# Altium schematic sheet kernel.SchDoc
size A1
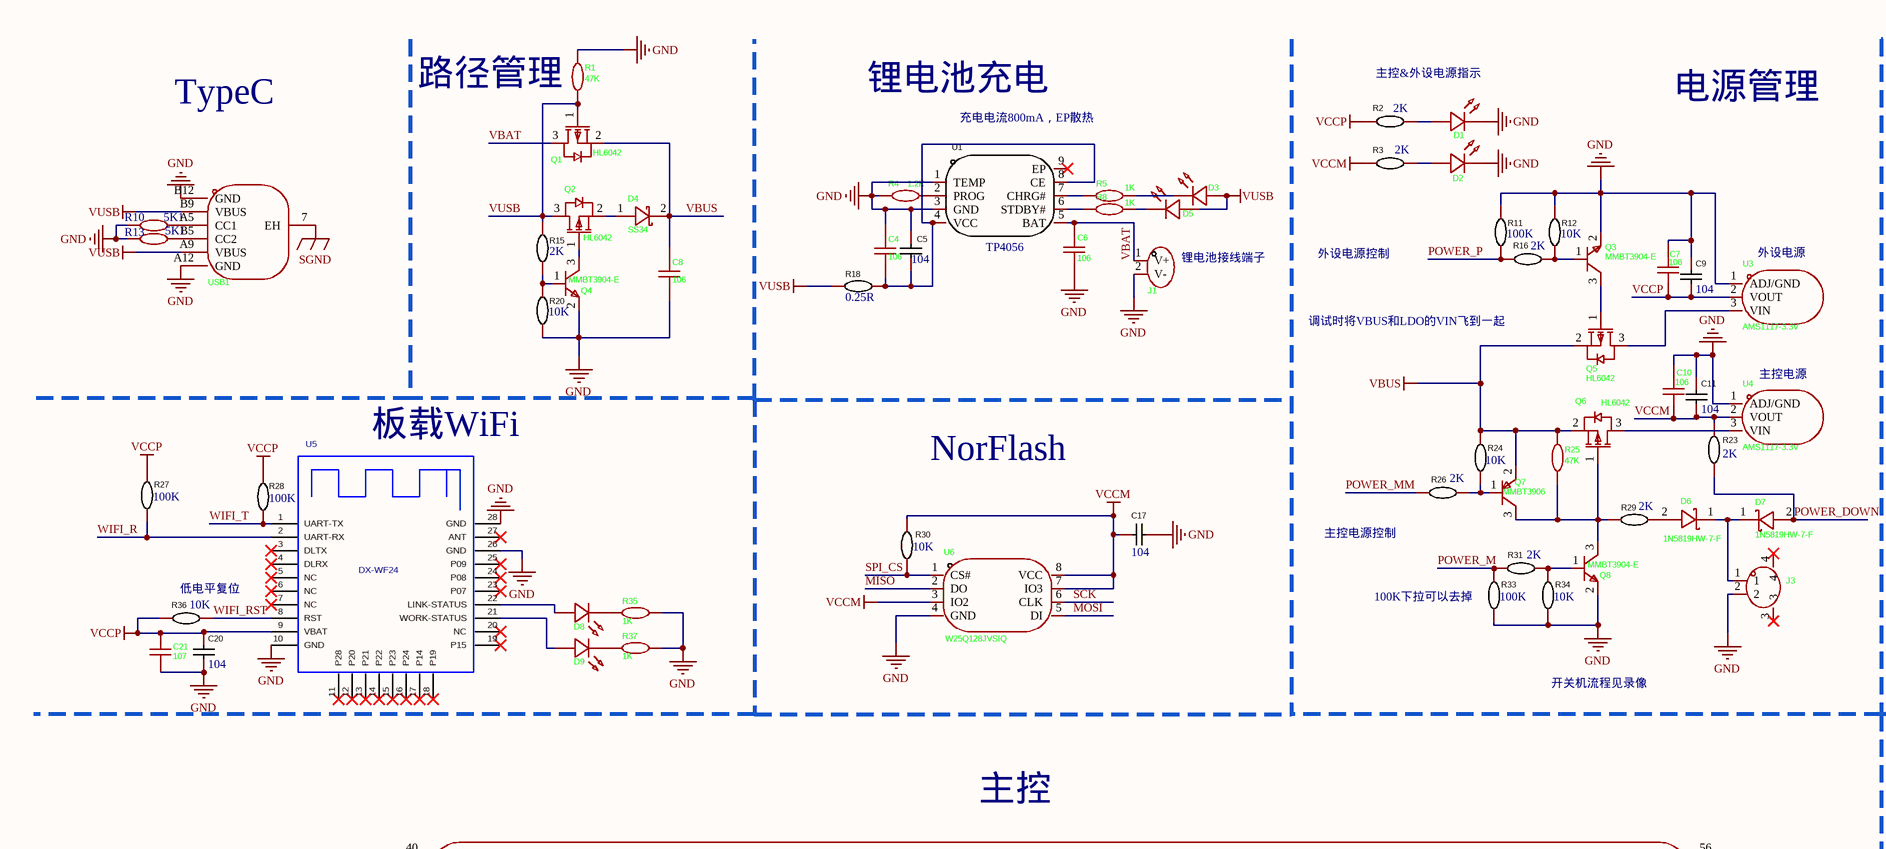
[diagram p0: kernel.SchDoc, top left]
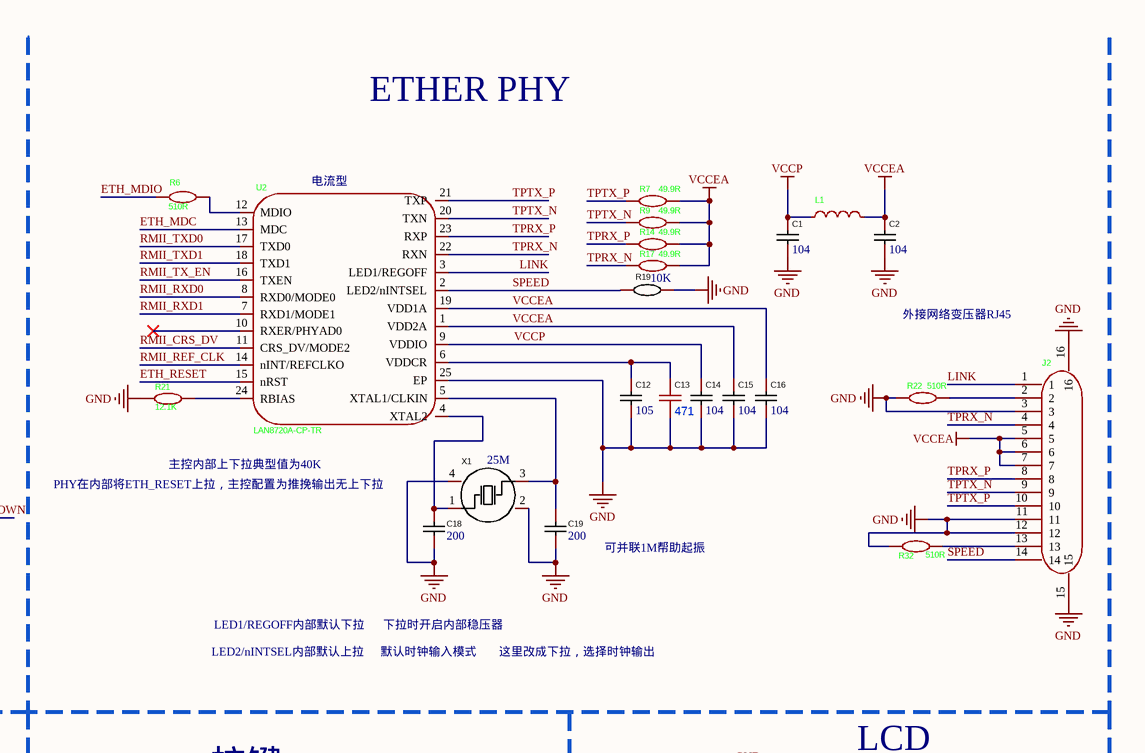
[diagram p1: kernel.SchDoc, top right]
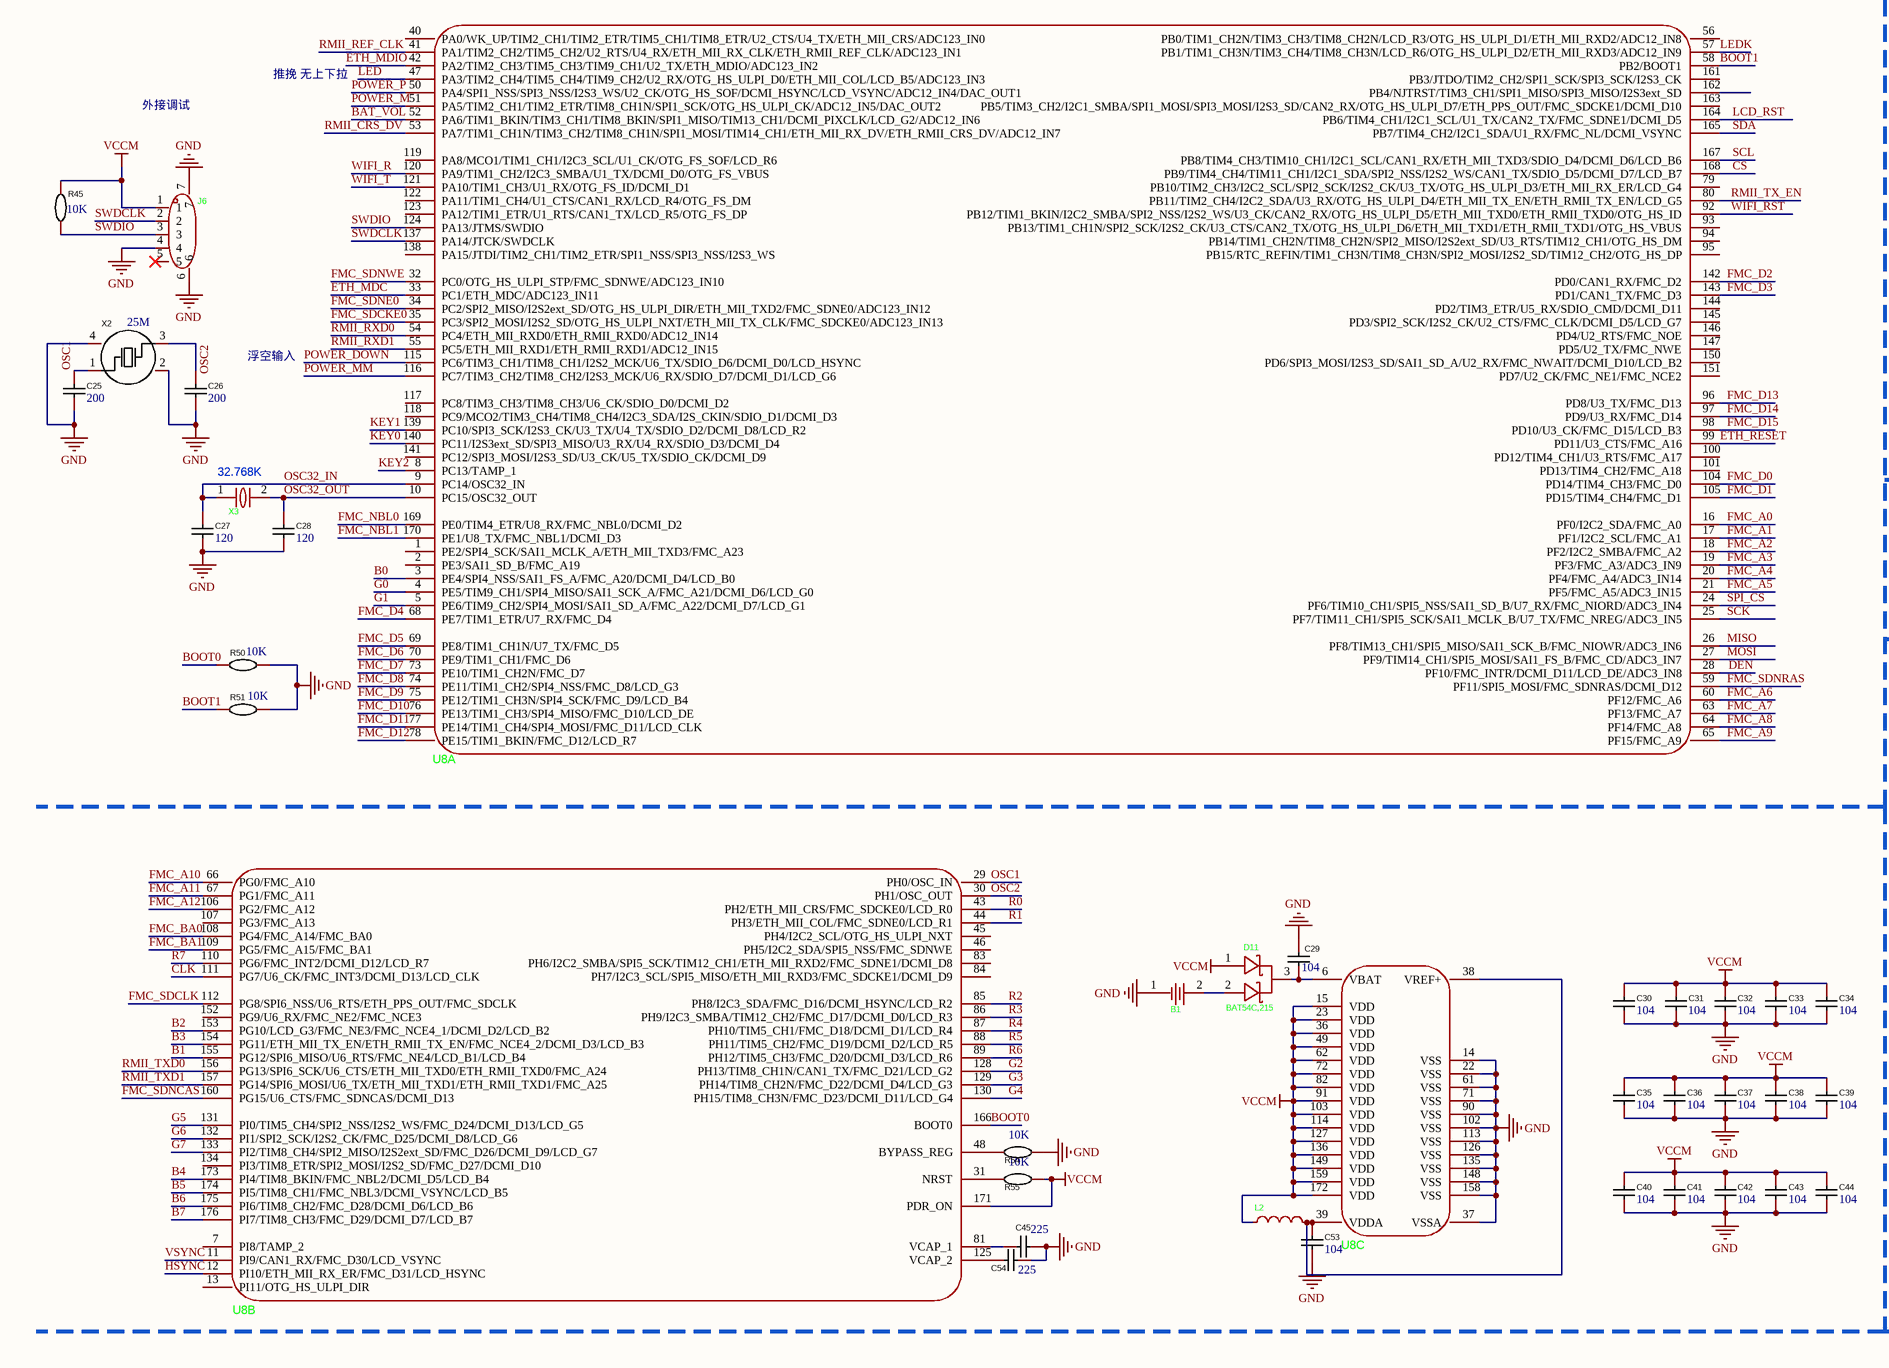
[diagram p2: kernel.SchDoc, bottom left]
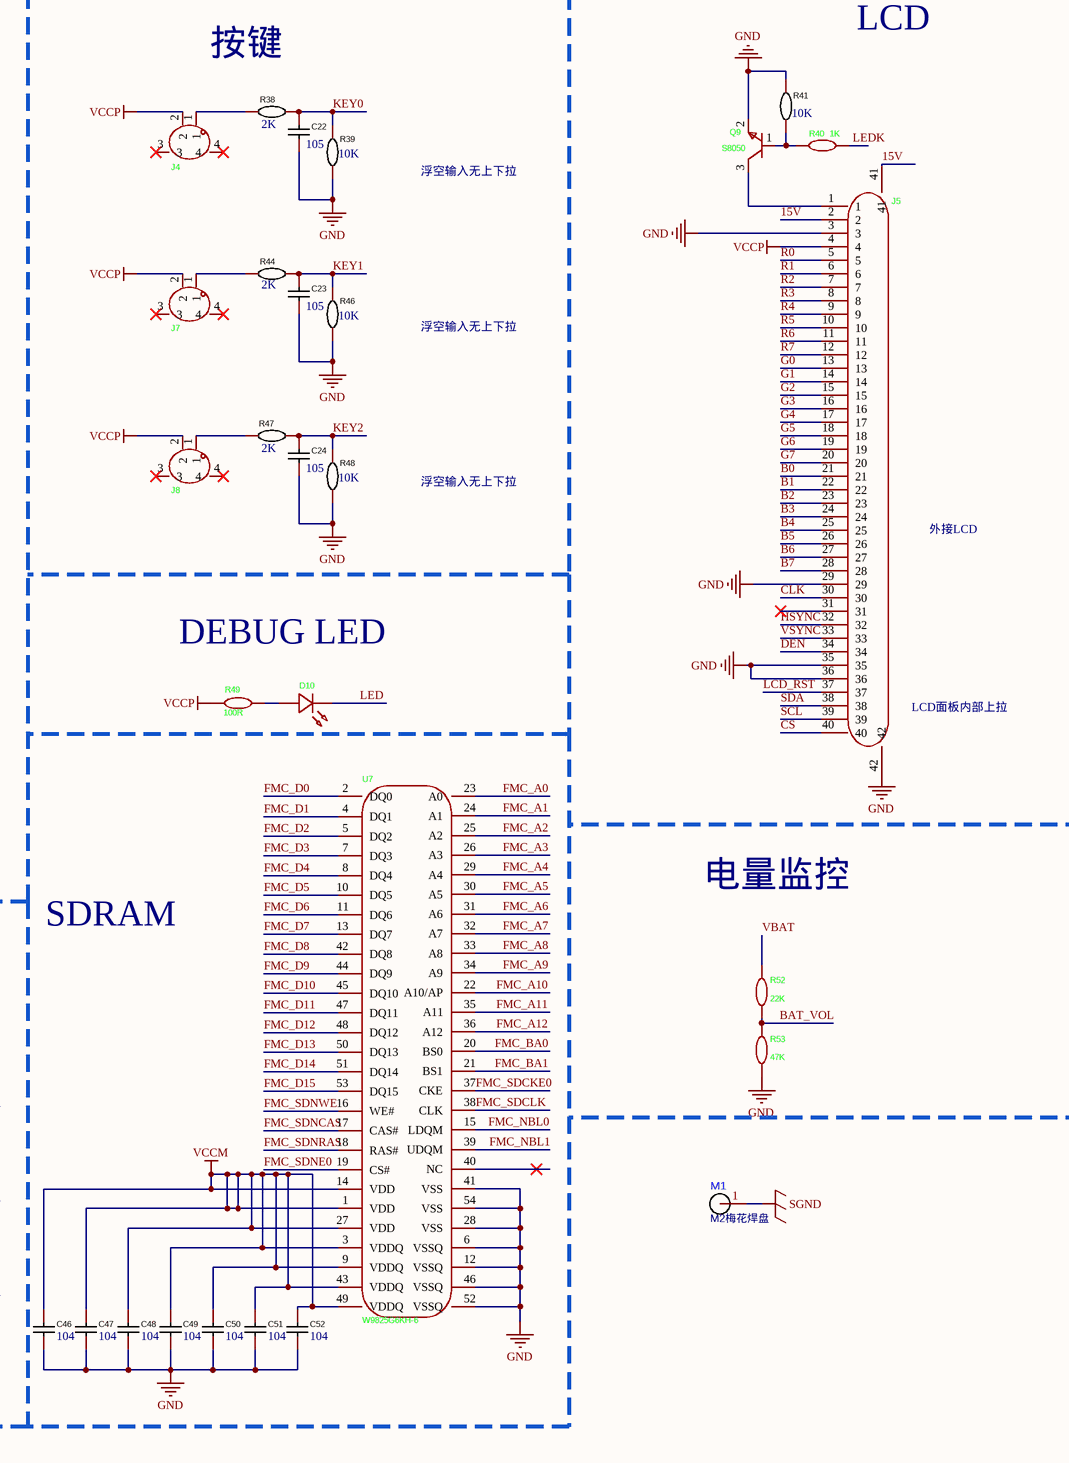
[diagram p3: kernel.SchDoc, bottom right]

## Parts
B1  BS-02-A1AJ010  [BAT-TH_BS-02-A1AJ010]  (value not drawn)
C1  104  [0402_C]
C2  104  [0402_C]
C4  106  [0603_C]
C5  104  [0402_C]
C6  106  [0603_C]
C7  106  [0603_C]
C8  106  [0603_C]
C9  104  [0402_C]
C10  106  [0603_C]
C11  104  [0402_C]
C12  105  [0402_C]
C13  471  [0402_C]
C14  104  [0402_C]
C15  104  [0402_C]
C16  104  [0402_C]
C17  104  [0402_C]
C18  200  [0402_C]
C19  200  [0402_C]
C20  104  [0402_C]
C21  107  [1206_C]
C22  105  [0402_C]
C23  105  [0402_C]
C24  105  [0402_C]
C25  200  [0402_C]
C26  200  [0402_C]
C27  120  [0402_C]
C28  120  [0402_C]
C29  104  [0402_C]
C30  104  [0402_C]
C31  104  [0402_C]
C32  104  [0402_C]
C33  104  [0402_C]
C34  104  [0402_C]
C35  104  [0402_C]
C36  104  [0402_C]
C37  104  [0402_C]
C38  104  [0402_C]
C39  104  [0402_C]
C40  104  [0402_C]
C41  104  [0402_C]
C42  104  [0402_C]
C43  104  [0402_C]
C44  104  [0402_C]
C45  225  [0402_C]
C46  104  [0402_C]
C47  104  [0402_C]
C48  104  [0402_C]
C49  104  [0402_C]
C50  104  [0402_C]
C51  104  [0402_C]
C52  104  [0402_C]
C53  104  [0402_C]
C54  225  [0402_C]
D1  XL-1005SYGC  [LED-SMD_L1.1-W0.6-FD]  (value not drawn)
D2  XL-1005SYGC  [LED-SMD_L1.1-W0.6-FD]  (value not drawn)
D3  XL-1005SYGC  [LED-SMD_L1.1-W0.6-FD]  (value not drawn)
D4  SS34  [SMA_L4.3-W2.6-LS5.0-FD]
D5  XL-1005SURC  [LED0402-RD]  (value not drawn)
D6  1N5819HW-7-F  [SOD-123_L2.7-W1.6-LS3.7-RD]
D7  1N5819HW-7-F  [SOD-123_L2.7-W1.6-LS3.7-RD]
D8  XL-1005SURC  [LED0402-RD]  (value not drawn)
D9  XL-1005SURC  [LED0402-RD]  (value not drawn)
D10  XL-1005UOC  [LED0402-RD_ORANGE]  (value not drawn)
D11  BAT54C,215  [SOT-23-3_L2.9-W1.6-P1.90-LS2.8-BR]
J1  ZX-XH2.54-2PZZ  [CONN-TH_2P-P2.50_HX25003-2A]  (value not drawn)
J2  AFC01-S14FCA-00  [FPC-SMD_AFC01-S14FCA-00]  (value not drawn)
J3  WAFER-SH1.0-2PWB  [CONN-SMD_2P-P1.00_XUNPU_WAFER-SH1.0-2PWB]  (value not drawn)
J4  WAFER-SH1.0-2PWB  [CONN-SMD_2P-P1.00_XUNPU_WAFER-SH1.0-2PWB]  (value not drawn)
J5  AFC01-S40FCA-00  [FPC-SMD_AFC01-S40FCA-00]  (value not drawn)
J6  AFC01-S05FCA-00  [FPC-SMD_AFC01-S05FCA-00]  (value not drawn)
J7  WAFER-SH1.0-2PWB  [CONN-SMD_2P-P1.00_XUNPU_WAFER-SH1.0-2PWB]  (value not drawn)
J8  WAFER-SH1.0-2PWB  [CONN-SMD_2P-P1.00_XUNPU_WAFER-SH1.0-2PWB]  (value not drawn)
L1  BLM21PG221SN1D  [0805_L]  (value not drawn)
L2  BLM15AG100SN1D  [0402_L]  (value not drawn)
M1  M2梅花焊盘  [PCBComponent_1 - duplicate]
Q1  HL6042  [SOT-23-3_L2.9-W1.4-P1.90-LS2.5-BR]
Q2  HL6042  [SOT-23-3_L2.9-W1.4-P1.90-LS2.5-BR]
Q3  MMBT3904-E  [SOT-23-3_L2.9-W1.4-P1.90-LS2.5-BR]
Q4  MMBT3904-E  [SOT-23-3_L2.9-W1.4-P1.90-LS2.5-BR]
Q5  HL6042  [SOT-23-3_L2.9-W1.4-P1.90-LS2.5-BR]
Q6  HL6042  [SOT-23-3_L2.9-W1.4-P1.90-LS2.5-BR]
Q7  MMBT3906  [SOT-23-3_L2.9-W1.3-P1.90-LS2.4-BR]
Q8  MMBT3904-E  [SOT-23-3_L2.9-W1.4-P1.90-LS2.5-BR]
Q9  S8050  [SOT-23-3_L3.0-W1.7-P0.95-LS2.9-BR]
R1  47K  [0402_R]
R2  2K  [0402_R]
R3  2K  [0402_R]
R4  1.2K  [0603_R]
R5  1K  [0402_R]
R6  510R  [0603_R]
R7  49.9R  [0603_R]
R8  1K  [0402_R]
R9  49.9R  [0603_R]
R10  5K1  [0402_R]
R11  100K  [0402_R]
R12  10K  [0402_R]
R13  5K1  [0402_R]
R14  49.9R  [0603_R]
R15  2K  [0402_R]
R16  2K  [0402_R]
R17  49.9R  [0603_R]
R18  0.25R  [1206_R]
R19  10K  [0402_R]
R20  10K  [0402_R]
R21  12.1K  [0603_R]
R22  510R  [0603_R]
R23  2K  [0402_R]
R24  10K  [0402_R]
R25  47K  [0402_R]
R26  2K  [0402_R]
R27  100K  [0402_R]
R28  100K  [0402_R]
R29  2K  [0402_R]
R30  10K  [0402_R]
R31  2K  [0402_R]
R32  510R  [0603_R]
R33  100K  [0402_R]
R34  10K  [0402_R]
R35  1K  [0402_R]
R36  10K  [0402_R]
R37  1K  [0402_R]
R38  2K  [0402_R]
R39  10K  [0402_R]
R40  1K  [0402_R]
R41  10K  [0402_R]
R44  2K  [0402_R]
R45  10K  [0402_R]
R46  10K  [0402_R]
R47  2K  [0402_R]
R48  10K  [0402_R]
R49  100R  [0402_R]
R50  10K  [0402_R]
R51  10K  [0402_R]
R52  22K  [0402_R]
R53  47K  [0402_R]
R54  10K  [0402_R]
R55  10K  [0402_R]
U1  TP4056  [ESOP-8_L4.9-W3.9-P1.27-LS6.0-BL-EP]
U2  LAN8720A-CP-TR  [QFN-24_L4.0-W4.0-P0.50-BL-EP2.6]
U3  AMS1117-3.3V  [SOT-89-3_L4.5-W2.5-P1.50-LS4.2-BR]
U4  AMS1117-3.3V  [SOT-89-3_L4.5-W2.5-P1.50-LS4.2-BR]
U5  DX-WF24  [DX-WF24-SMT]
U6  W25Q128JVSIQ  [SOIC-8_L5.3-W5.3-P1.27-LS8.0-BL]
U7  W9825G6KH-6  [TSOP-54_L22.2-W10.2-P0.80-LS11.8-BL]
U8  STM32F429IGT6  [LQFP-176_L24.0-W24.0-P0.50-LS26.0-BL]  (value not drawn)  (parts A,B,C of 3)
USB1  TYPE-C 6P  [TYPE-C-SMD_TYPE-C-6P]  (value not drawn)
X1  25M  [SMD-3225_4P]
X2  25M  [SMD-3225_4P]
X3  32.768K  [SMD3225-2P]

## Nets
GND: B1.1 C1.1 C2.1 C4.2 C5.2 C6.1 C7.2 C8.1 C9.2 C10.2 C11.2 C12.1 C13.1 C14.1 C15.1 C16.1 C17.2 C18.2 C19.2 C20.1 C21.1 C22.1 C23.1 C24.1 C25.2 C26.2 C27.1 C28.1 C29.2 C30.1 C31.1 C32.1 C33.1 C34.1 C35.1 C36.1 C37.1 C38.1 C39.1 C40.1 C41.1 C42.1 C43.1 C44.1 C45.2 C46.1 C47.1 C48.1 C49.1 C50.1 C51.1 C52.1 C53.1 C54.2 D1.1(K) D2.1(K) J1.2(V-) J2.3 J2.11 J2.12 J2.15 J2.16 J3.2 J5.3 J5.29 J5.35 J5.36 J5.42 J6.4 J6.6 J6.7 Q3.2(E) Q4.2(E) Q8.2(E) Q9.2(E) R1.2 R4.1 R10.1 R11.2 R12.2 R13.1 R19.2 R20.1 R21.1 R22.1 R32.1 R33.1 R34.1 R35.2 R37.2 R39.2 R41.2 R46.2 R48.2 R50.2 R51.2 R53.1 R54.2 U1.1(TEMP) U1.3(GND) U2.25(EP) U3.1(ADJ/GND) U4.1(ADJ/GND) U5.10(GND) U5.26(GND) U5.28(GND) U6.4(GND) U7.6(VSSQ) U7.12(VSSQ) U7.28(VSS) U7.41(VSS) U7.46(VSSQ) U7.52(VSSQ) U7.54(VSS) U8.14(VSS) U8.22(VSS) U8.37(VSSA) U8.61(VSS) U8.71(VSS) U8.90(VSS) U8.102(VSS) U8.113(VSS) U8.126(VSS) U8.135(VSS) U8.148(VSS) U8.158(VSS) USB1.A12(GND) USB1.B12(GND) X1.2(GND) X1.4(GND) X2.2(GND) X2.4(GND)
SGND: M1.1 USB1.7(EH)
VBUS: C8.2 D4.2(K) Q1.2(S) Q5.2(S) Q6.2(S) Q7.2(E) R24.2 R25.2
VCCEA: C2.2 C15.2 C16.2 J2.5 J2.6 J2.7 L1.2 R7.2 R9.2 R14.2 R17.2 U2.1(VDD2A) U2.19(VDD1A)
VCCM: C10.1 C11.1 C17.1 C30.2 C31.2 C32.2 C33.2 C34.2 C35.2 C36.2 C37.2 C38.2 C39.2 C40.2 C41.2 C42.2 C43.2 C44.2 C46.2 C47.2 C48.2 C49.2 C50.2 C51.2 C52.2 D11.1(A) J6.1 L2.1 R3.1 R23.2 R30.2 R45.1 R55.2 U4.2(VOUT) U6.3(IO2) U6.7(IO3) U6.8(VCC) U7.1(VDD) U7.3(VDDQ) U7.9(VDDQ) U7.14(VDD) U7.27(VDD) U7.43(VDDQ) U7.49(VDDQ) U8.15(VDD) U8.23(VDD) U8.36(VDD) U8.49(VDD) U8.62(VDD) U8.72(VDD) U8.82(VDD) U8.91(VDD) U8.103(VDD) U8.114(VDD) U8.127(VDD) U8.136(VDD) U8.149(VDD) U8.159(VDD) U8.171(PDR_ON) U8.172(VDD)
VCCP: C1.2 C7.1 C9.1 C14.2 C20.2 C21.2 J4.2 J5.4 J7.2 J8.2 L1.1 R2.1 R27.2 R28.2 R36.2 R49.1 U2.9(VDDIO) U3.2(VOUT) U5.9(VBAT)
VUSB: D3.2(A) D5.2(A) Q1.1(G) Q2.3(D) R1.1 R15.1 R18.1 USB1.A9(VBUS) USB1.B9(VBUS)
15V: J5.2 J5.41
B0: J5.21 U8.3(PE4/SPI4_NSS/SAI1_FS_A/FMC_A20/DCMI_D4/LCD_B0)
B1: J5.22 U8.155(PG12/SPI6_MISO/U6_RTS/FMC_NE4/LCD_B1/LCD_B4)
B2: J5.23 U8.153(PG10/LCD_G3/FMC_NE3/FMC_NCE4_1/DCMI_D2/LCD_B2)
B3: J5.24 U8.154(PG11/ETH_MII_TX_EN/ETH_RMII_TX_EN/FMC_NCE4_2/DCMI_D3/LCD_B3)
B4: J5.25 U8.173(PI4/TIM8_BKIN/FMC_NBL2/DCMI_D5/LCD_B4)
B5: J5.26 U8.174(PI5/TIM8_CH1/FMC_NBL3/DCMI_VSYNC/LCD_B5)
B6: J5.27 U8.175(PI6/TIM8_CH2/FMC_D28/DCMI_D6/LCD_B6)
B7: J5.28 U8.176(PI7/TIM8_CH3/FMC_D29/DCMI_D7/LCD_B7)
BAT_VOL: R52.1 R53.2 U8.52(PA6/TIM1_BKIN/TIM3_CH1/TIM8_BKIN/SPI1_MISO/TIM13_CH1/DCMI_PIXCLK/LCD_G2/ADC12_IN6)
BOOT0: R50.1 U8.166(BOOT0)
BOOT1: R51.1 U8.58(PB2/BOOT1)
CLK: J5.30 U8.111(PG7/U6_CK/FMC_INT3/DCMI_D13/LCD_CLK)
CS: J5.40 U8.168(PB9/TIM4_CH4/TIM11_CH1/I2C1_SDA/SPI2_NSS/I2S2_WS/CAN1_TX/SDIO_D5/DCMI_D7/LCD_B7)
DEN: J5.34 U8.28(PF10/FMC_INTR/DCMI_D11/LCD_DE/ADC3_IN8)
ETH_MDC: U2.13(MDC) U8.33(PC1/ETH_MDC/ADC123_IN11)
ETH_MDIO: R6.1 U8.42(PA2/TIM2_CH3/TIM5_CH3/TIM9_CH1/U2_TX/ETH_MDIO/ADC123_IN2)
ETH_RESET: U2.15(nRST) U8.99(PD11/U3_CTS/FMC_A16)
FMC_A0: U7.23(A0) U8.16(PF0/I2C2_SDA/FMC_A0)
FMC_A1: U7.24(A1) U8.17(PF1/I2C2_SCL/FMC_A1)
FMC_A2: U7.25(A2) U8.18(PF2/I2C2_SMBA/FMC_A2)
FMC_A3: U7.26(A3) U8.19(PF3/FMC_A3/ADC3_IN9)
FMC_A4: U7.29(A4) U8.20(PF4/FMC_A4/ADC3_IN14)
FMC_A5: U7.30(A5) U8.21(PF5/FMC_A5/ADC3_IN15)
FMC_A6: U7.31(A6) U8.60(PF12/FMC_A6)
FMC_A7: U7.32(A7) U8.63(PF13/FMC_A7)
FMC_A8: U7.33(A8) U8.64(PF14/FMC_A8)
FMC_A9: U7.34(A9) U8.65(PF15/FMC_A9)
FMC_A10: U7.22(A10/AP) U8.66(PG0/FMC_A10)
FMC_A11: U7.35(A11) U8.67(PG1/FMC_A11)
FMC_A12: U7.36(A12) U8.106(PG2/FMC_A12)
FMC_BA0: U7.20(BS0) U8.108(PG4/FMC_A14/FMC_BA0)
FMC_BA1: U7.21(BS1) U8.109(PG5/FMC_A15/FMC_BA1)
FMC_D0: U7.2(DQ0) U8.104(PD14/TIM4_CH3/FMC_D0)
FMC_D1: U7.4(DQ1) U8.105(PD15/TIM4_CH4/FMC_D1)
FMC_D2: U7.5(DQ2) U8.142(PD0/CAN1_RX/FMC_D2)
FMC_D3: U7.7(DQ3) U8.143(PD1/CAN1_TX/FMC_D3)
FMC_D4: U7.8(DQ4) U8.68(PE7/TIM1_ETR/U7_RX/FMC_D4)
FMC_D5: U7.10(DQ5) U8.69(PE8/TIM1_CH1N/U7_TX/FMC_D5)
FMC_D6: U7.11(DQ6) U8.70(PE9/TIM1_CH1/FMC_D6)
FMC_D7: U7.13(DQ7) U8.73(PE10/TIM1_CH2N/FMC_D7)
FMC_D8: U7.42(DQ8) U8.74(PE11/TIM1_CH2/SPI4_NSS/FMC_D8/LCD_G3)
FMC_D9: U7.44(DQ9) U8.75(PE12/TIM1_CH3N/SPI4_SCK/FMC_D9/LCD_B4)
FMC_D10: U7.45(DQ10) U8.76(PE13/TIM1_CH3/SPI4_MISO/FMC_D10/LCD_DE)
FMC_D11: U7.47(DQ11) U8.77(PE14/TIM1_CH4/SPI4_MOSI/FMC_D11/LCD_CLK)
FMC_D12: U7.48(DQ12) U8.78(PE15/TIM1_BKIN/FMC_D12/LCD_R7)
FMC_D13: U7.50(DQ13) U8.96(PD8/U3_TX/FMC_D13)
FMC_D14: U7.51(DQ14) U8.97(PD9/U3_RX/FMC_D14)
FMC_D15: U7.53(DQ15) U8.98(PD10/U3_CK/FMC_D15/LCD_B3)
FMC_NBL0: U7.15(LDQM) U8.169(PE0/TIM4_ETR/U8_RX/FMC_NBL0/DCMI_D2)
FMC_NBL1: U7.39(UDQM) U8.170(PE1/U8_TX/FMC_NBL1/DCMI_D3)
FMC_SDCKE0: U7.37(CKE) U8.35(PC3/SPI2_MOSI/I2S2_SD/OTG_HS_ULPI_NXT/ETH_MII_TX_CLK/FMC_SDCKE0/ADC123_IN13)
FMC_SDCLK: U7.38(CLK) U8.112(PG8/SPI6_NSS/U6_RTS/ETH_PPS_OUT/FMC_SDCLK)
FMC_SDNCAS: U7.17(CAS#) U8.160(PG15/U6_CTS/FMC_SDNCAS/DCMI_D13)
FMC_SDNE0: U7.19(CS#) U8.34(PC2/SPI2_MISO/I2S2ext_SD/OTG_HS_ULPI_DIR/ETH_MII_TXD2/FMC_SDNE0/ADC123_IN12)
FMC_SDNRAS: U7.18(RAS#) U8.59(PF11/SPI5_MOSI/FMC_SDNRAS/DCMI_D12)
FMC_SDNWE: U7.16(WE#) U8.32(PC0/OTG_HS_ULPI_STP/FMC_SDNWE/ADC123_IN10)
G0: J5.13 U8.4(PE5/TIM9_CH1/SPI4_MISO/SAI1_SCK_A/FMC_A21/DCMI_D6/LCD_G0)
G1: J5.14 U8.5(PE6/TIM9_CH2/SPI4_MOSI/SAI1_SD_A/FMC_A22/DCMI_D7/LCD_G1)
G2: J5.15 U8.128(PH13/TIM8_CH1N/CAN1_TX/FMC_D21/LCD_G2)
G3: J5.16 U8.129(PH14/TIM8_CH2N/FMC_D22/DCMI_D4/LCD_G3)
G4: J5.17 U8.130(PH15/TIM8_CH3N/FMC_D23/DCMI_D11/LCD_G4)
G5: J5.18 U8.131(PI0/TIM5_CH4/SPI2_NSS/I2S2_WS/FMC_D24/DCMI_D13/LCD_G5)
G6: J5.19 U8.132(PI1/SPI2_SCK/I2S2_CK/FMC_D25/DCMI_D8/LCD_G6)
G7: J5.20 U8.133(PI2/TIM8_CH4/SPI2_MISO/I2S2ext_SD/FMC_D26/DCMI_D9/LCD_G7)
HSYNC: J5.32 U8.12(PI10/ETH_MII_RX_ER/FMC_D31/LCD_HSYNC)
KEY0: C22.2 R38.2 R39.1 U8.140(PC11/I2S3ext_SD/SPI3_MISO/U3_RX/U4_RX/SDIO_D3/DCMI_D4)
KEY1: C23.2 R44.2 R46.1 U8.139(PC10/SPI3_SCK/I2S3_CK/U3_TX/U4_TX/SDIO_D2/DCMI_D8/LCD_R2)
KEY2: C24.2 R47.2 R48.1 U8.8(PC13/TAMP_1)
LCD_RST: J5.37 U8.164(PB6/TIM4_CH1/I2C1_SCL/U1_TX/CAN2_TX/FMC_SDNE1/DCMI_D5)
LED: D10.1(K) U8.47(PA3/TIM2_CH4/TIM5_CH4/TIM9_CH2/U2_RX/OTG_HS_ULPI_D0/ETH_MII_COL/LCD_B5/ADC123_IN3)
LEDK: R40.2 U8.57(PB1/TIM1_CH3N/TIM3_CH4/TIM8_CH3N/LCD_R6/OTG_HS_ULPI_D2/ETH_MII_RXD3/ADC12_IN9)
LINK: J2.1 U2.3(LED1/REGOFF)
MISO: U6.2(DO) U8.26(PF8/TIM13_CH1/SPI5_MISO/SAI1_SCK_B/FMC_NIOWR/ADC3_IN6)
MOSI: U6.5(DI) U8.27(PF9/TIM14_CH1/SPI5_MOSI/SAI1_FS_B/FMC_CD/ADC3_IN7)
OSC1: C25.1 U8.29(PH0/OSC_IN) X2.1(OSC1)
OSC2: C26.1 U8.30(PH1/OSC_OUT) X2.3(OSC2)
OSC32_IN: C27.2 U8.9(PC14/OSC32_IN) X3.1
OSC32_OUT: C28.2 U8.10(PC15/OSC32_OUT) X3.2
POWER_DOWN: D7.2(A) R23.1 U8.115(PC6/TIM3_CH1/TIM8_CH1/I2S2_MCK/U6_TX/SDIO_D6/DCMI_D0/LCD_HSYNC)
POWER_M: R31.1 R33.2 U8.51(PA5/TIM2_CH1/TIM2_ETR/TIM8_CH1N/SPI1_SCK/OTG_HS_ULPI_CK/ADC12_IN5/DAC_OUT2)
POWER_MM: R26.1 U8.116(PC7/TIM3_CH2/TIM8_CH2/I2S3_MCK/U6_RX/SDIO_D7/DCMI_D1/LCD_G6)
POWER_P: R11.1 R16.1 U8.50(PA4/SPI1_NSS/SPI3_NSS/I2S3_WS/U2_CK/OTG_HS_SOF/DCMI_HSYNC/LCD_VSYNC/ADC12_IN4/DAC_OUT1)
R0: J5.5 U8.43(PH2/ETH_MII_CRS/FMC_SDCKE0/LCD_R0)
R1: J5.6 U8.44(PH3/ETH_MII_COL/FMC_SDNE0/LCD_R1)
R2: J5.7 U8.85(PH8/I2C3_SDA/FMC_D16/DCMI_HSYNC/LCD_R2)
R3: J5.8 U8.86(PH9/I2C3_SMBA/TIM12_CH2/FMC_D17/DCMI_D0/LCD_R3)
R4: J5.9 U8.87(PH10/TIM5_CH1/FMC_D18/DCMI_D1/LCD_R4)
R5: J5.10 U8.88(PH11/TIM5_CH2/FMC_D19/DCMI_D2/LCD_R5)
R6: J5.11 U8.89(PH12/TIM5_CH3/FMC_D20/DCMI_D3/LCD_R6)
R7: J5.12 U8.110(PG6/FMC_INT2/DCMI_D12/LCD_R7)
RMII_CRS_DV: U2.11(CRS_DV/MODE2) U8.53(PA7/TIM1_CH1N/TIM3_CH2/TIM8_CH1N/SPI1_MOSI/TIM14_CH1/ETH_MII_RX_DV/ETH_RMII_CRS_DV/ADC12_IN7)
RMII_REF_CLK: U2.14(nINT/REFCLKO) U8.41(PA1/TIM2_CH2/TIM5_CH2/U2_RTS/U4_RX/ETH_MII_RX_CLK/ETH_RMII_REF_CLK/ADC123_IN1)
RMII_RXD0: U2.8(RXD0/MODE0) U8.54(PC4/ETH_MII_RXD0/ETH_RMII_RXD0/ADC12_IN14)
RMII_RXD1: U2.7(RXD1/MODE1) U8.55(PC5/ETH_MII_RXD1/ETH_RMII_RXD1/ADC12_IN15)
RMII_TX_EN: U2.16(TXEN) U8.80(PB11/TIM2_CH4/I2C2_SDA/U3_RX/OTG_HS_ULPI_D4/ETH_MII_TX_EN/ETH_RMII_TX_EN/LCD_G5)
RMII_TXD0: U2.17(TXD0) U8.156(PG13/SPI6_SCK/U6_CTS/ETH_MII_TXD0/ETH_RMII_TXD0/FMC_A24)
RMII_TXD1: U2.18(TXD1) U8.157(PG14/SPI6_MOSI/U6_TX/ETH_MII_TXD1/ETH_RMII_TXD1/FMC_A25)
SCK: U6.6(CLK) U8.25(PF7/TIM11_CH1/SPI5_SCK/SAI1_MCLK_B/U7_TX/FMC_NREG/ADC3_IN5)
SCL: J5.39 U8.167(PB8/TIM4_CH3/TIM10_CH1/I2C1_SCL/CAN1_RX/ETH_MII_TXD3/SDIO_D4/DCMI_D6/LCD_B6)
SDA: J5.38 U8.165(PB7/TIM4_CH2/I2C1_SDA/U1_RX/FMC_NL/DCMI_VSYNC)
SPEED: J2.14 R19.1 U2.2(LED2/nINTSEL)
SPI_CS: R30.1 U6.1(CS#) U8.24(PF6/TIM10_CH1/SPI5_NSS/SAI1_SD_B/U7_RX/FMC_NIORD/ADC3_IN4)
SWDCLK: J6.2 U8.137(PA14/JTCK/SWDCLK)
SWDIO: J6.3 R45.2 U8.124(PA13/JTMS/SWDIO)
TPRX_N: J2.4 R17.1 U2.22(RXN)
TPRX_P: J2.8 R14.1 U2.23(RXP)
TPTX_N: J2.9 R9.1 U2.20(TXN)
TPTX_P: J2.10 R7.1 U2.21(TXP)
VBAT: C6.2 J1.1(V+) Q1.3(D) R52.2 U1.5(BAT)
VSYNC: J5.33 U8.11(PI9/CAN1_RX/FMC_D30/LCD_VSYNC)
WIFI_R: R27.1 U5.2(UART-RX) U8.120(PA9/TIM1_CH2/I2C3_SMBA/U1_TX/DCMI_D0/OTG_FS_VBUS)
WIFI_RST: R36.1 U5.8(RST) U8.92(PB12/TIM1_BKIN/I2C2_SMBA/SPI2_NSS/I2S2_WS/U3_CK/CAN2_RX/OTG_HS_ULPI_D5/ETH_MII_TXD0/ETH_RMII_TXD0/OTG_HS_ID)
WIFI_T: R28.1 U5.1(UART-TX) U8.121(PA10/TIM1_CH3/U1_RX/OTG_FS_ID/DCMI_D1)
NetB1_2: B1.2 D11.2(A)
NetC4_1: C4.1 C5.1 R18.2 U1.4(VCC) U1.8(CE)
NetC12_2: C12.2 C13.2 U2.6(VDDCR)
NetC18_1: C18.1 U2.4(XTAL2) X1.1(OSC1)
NetC19_1: C19.1 U2.5(XTAL1/CLKIN) X1.3(OSC2)
NetC29_1: C29.1 D11.3(K) U8.6(VBAT)
NetC45_1: C45.1 U8.81(VCAP_1)
NetC53_2: C53.2 L2.2 U8.38(VREF+) U8.39(VDDA)
NetC54_1: C54.1 U8.125(VCAP_2)
NetD1_2: D1.2(A) R2.2
NetD2_2: D2.2(A) R3.2
NetD3_1: D3.1(K) R5.2
NetD4_1: D4.1(A) Q2.2(S)
NetD5_1: D5.1(K) R8.2
NetD6_1: D6.1(K) D7.1(K) J3.1
NetD6_2: D6.2(A) R29.2
NetD8_1: D8.1(K) R35.1
NetD8_2: D8.2(A) U5.22(LINK-STATUS)
NetD9_1: D9.1(K) R37.1
NetD9_2: D9.2(A) U5.21(WORK-STATUS)
NetD10_2: D10.2(A) R49.2
NetJ2_2: J2.2 R22.2
NetJ2_13: J2.13 R32.2
NetJ4_1: J4.1 R38.1
NetJ5_1: J5.1 Q9.3(C)
NetJ7_1: J7.1 R44.1
NetJ8_1: J8.1 R47.1
NetQ2_1: Q2.1(G) Q4.3(C)
NetQ3_1: Q3.1(B) R12.1 R16.2
NetQ3_3: Q3.3(C) Q5.1(G)
NetQ4_1: Q4.1(B) R15.2 R20.2
NetQ5_3: Q5.3(D) U3.3(VIN)
NetQ6_1: Q6.1(G) Q7.3(C) Q8.3(C) R25.1 R29.1
NetQ6_3: Q6.3(D) U4.3(VIN)
NetQ7_1: Q7.1(B) R24.1 R26.2
NetQ8_1: Q8.1(B) R31.2 R34.2
NetQ9_1: Q9.1(B) R40.1 R41.1
NetR4_2: R4.2 U1.2(PROG)
NetR5_1: R5.1 U1.7(CHRG#)
NetR6_2: R6.2 U2.12(MDIO)
NetR8_1: R8.1 U1.6(STDBY#)
NetR10_2: R10.2 USB1.A5(CC1)
NetR13_2: R13.2 USB1.B5(CC2)
NetR21_2: R21.2 U2.24(RBIAS)
NetR54_1: R54.1 U8.48(BYPASS_REG)
NetR55_1: R55.1 U8.31(NRST)

Not connected (* = marked no-connect by the designer): J3 3* 4*; J4 3* 4*; J5 31*; J6 5*; J7 3* 4*; J8 3* 4*; U1 9(EP)*; U2 10(RXER/PHYAD0)*; U5 3(DLTX)* 4(DLRX)* 5(NC)* 6(NC)* 7(NC)* 11(P28)* 12(P20)* 13(P21)* 14(P22)* 15(P23)* 16(P24)* 17(P14)* 18(P19)* 19(P15)* 20(NC)* 23(P07)* 24(P08)* 25(P09)* 27(ANT)*; U7 40(NC)*; U8 1(PE2/SPI4_SCK/SAI1_MCLK_A/ETH_MII_TXD3/FMC_A23) 2(PE3/SAI1_SD_B/FMC_A19) 7(PI8/TAMP_2) 13(PI11/OTG_HS_ULPI_DIR) 40(PA0/WK_UP/TIM2_CH1/TIM2_ETR/TIM5_CH1/TIM8_ETR/U2_CTS/U4_TX/ETH_MII_CRS/ADC123_IN0) 45(PH4/I2C2_SCL/OTG_HS_ULPI_NXT) 46(PH5/I2C2_SDA/SPI5_NSS/FMC_SDNWE) 56(PB0/TIM1_CH2N/TIM3_CH3/TIM8_CH2N/LCD_R3/OTG_HS_ULPI_D1/ETH_MII_RXD2/ADC12_IN8) 79(PB10/TIM2_CH3/I2C2_SCL/SPI2_SCK/I2S2_CK/U3_TX/OTG_HS_ULPI_D3/ETH_MII_RX_ER/LCD_G4) 83(PH6/I2C2_SMBA/SPI5_SCK/TIM12_CH1/ETH_MII_RXD2/FMC_SDNE1/DCMI_D8) 84(PH7/I2C3_SCL/SPI5_MISO/ETH_MII_RXD3/FMC_SDCKE1/DCMI_D9) 93(PB13/TIM1_CH1N/SPI2_SCK/I2S2_CK/U3_CTS/CAN2_TX/OTG_HS_ULPI_D6/ETH_MII_TXD1/ETH_RMII_TXD1/OTG_HS_VBUS) 94(PB14/TIM1_CH2N/TIM8_CH2N/SPI2_MISO/I2S2ext_SD/U3_RTS/TIM12_CH1/OTG_HS_DM) 95(PB15/RTC_REFIN/TIM1_CH3N/TIM8_CH3N/SPI2_MOSI/I2S2_SD/TIM12_CH2/OTG_HS_DP) 100(PD12/TIM4_CH1/U3_RTS/FMC_A17) 101(PD13/TIM4_CH2/FMC_A18) 107(PG3/FMC_A13) 117(PC8/TIM3_CH3/TIM8_CH3/U6_CK/SDIO_D0/DCMI_D2) 118(PC9/MCO2/TIM3_CH4/TIM8_CH4/I2C3_SDA/I2S_CKIN/SDIO_D1/DCMI_D3) 119(PA8/MCO1/TIM1_CH1/I2C3_SCL/U1_CK/OTG_FS_SOF/LCD_R6) 122(PA11/TIM1_CH4/U1_CTS/CAN1_RX/LCD_R4/OTG_FS_DM) 123(PA12/TIM1_ETR/U1_RTS/CAN1_TX/LCD_R5/OTG_FS_DP) 134(PI3/TIM8_ETR/SPI2_MOSI/I2S2_SD/FMC_D27/DCMI_D10) 138(PA15/JTDI/TIM2_CH1/TIM2_ETR/SPI1_NSS/SPI3_NSS/I2S3_WS) 141(PC12/SPI3_MOSI/I2S3_SD/U3_CK/U5_TX/SDIO_CK/DCMI_D9) 144(PD2/TIM3_ETR/U5_RX/SDIO_CMD/DCMI_D11) 145(PD3/SPI2_SCK/I2S2_CK/U2_CTS/FMC_CLK/DCMI_D5/LCD_G7) 146(PD4/U2_RTS/FMC_NOE) 147(PD5/U2_TX/FMC_NWE) 150(PD6/SPI3_MOSI/I2S3_SD/SAI1_SD_A/U2_RX/FMC_NWAIT/DCMI_D10/LCD_B2) 151(PD7/U2_CK/FMC_NE1/FMC_NCE2) 152(PG9/U6_RX/FMC_NE2/FMC_NCE3) 161(PB3/JTDO/TIM2_CH2/SPI1_SCK/SPI3_SCK/I2S3_CK) 162(PB4/NJTRST/TIM3_CH1/SPI1_MISO/SPI3_MISO/I2S3ext_SD) 163(PB5/TIM3_CH2/I2C1_SMBA/SPI1_MOSI/SPI3_MOSI/I2S3_SD/CAN2_RX/OTG_HS_ULPI_D7/ETH_PPS_OUT/FMC_SDCKE1/DCMI_D10)

## Notes on the sheet
- TypeC
- 路径管理
- 锂电池充电
- (near U1) 充电电流800mA，EP散热
- 主控&外设电源指示
- 电源管理
- ETHER PHY
- (near U2) 电流型
- 锂电池接线端子
- 外设电源控制
- (near U3) 外设电源
- 调试时将VBUS和LDO的VIN飞到一起
- 外接网络变压器RJ45
- (near U4) 主控电源
- 板载WiFi
- NorFlash
- 主控内部上下拉典型值为40K
- 主控电源控制
- PHY在内部将ETH_RESET上拉，主控配置为推挽输出无上下拉
- (near R36) 低电平复位
- 100K下拉可以去掉
- (near C19) 可并联1M帮助起振
- LED2/nINTSEL内部默认上拉
- LED1/REGOFF内部默认下拉
- 默认时钟输入模式
- 下拉时开启内部稳压器
- 这里改成下拉，选择时钟输出
- 开关机流程见录像
- (near U8) 主控
- 按键
- LCD
- 外接调试
- 推挽 无上下拉
- 浮空输入无上下拉
- 浮空输入
- (near J5) 外接LCD
- DEBUG LED
- (near J5) LCD面板内部上拉
- 电量监控
- SDRAM

## Library data of the parts
B1 = BS-02-A1AJ010: CR2032电池座; Manufacturer: MYOUNG(美阳); Add into BOM: yes; Connector Type: 电池底座; Battery Type: CR2032; Symbol: BS-02-A1AJ010; Device: BS-02-A1AJ010; LCSC Part Name: 电池底座 适用电池:CR2032; Supplier Part: C5239862; Manufacturer Part: BS-02-A1AJ010; Supplier Footprint: 插件; JLCPCB Part Class: Extended Part; Datasheet: https://item.szlcsc.com/datasheet/BS-02-A1AJ010/5943286.html; Supplier: LCSC; Convert to PCB: yes; Contact Material: 磷青铜; Contact Plating: 镍; Operating Temperature: -25℃~+85℃
C1 C2 C5 C9 C11 C14-C17 C20 = 0402C_104: 电容100nf; Manufacturer: FH(风华); Name: 20pF; Symbol: 0402CG200J500NT; Add into BOM: yes; Value: 20pF; Tolerance: ±5%; Voltage Rated: 50V; Temperature Coefficient: C0G; Device: 0402CG200J500NT; LCSC Part Name: 20pF ±5% 50V; Supplier Part: C1554; Manufacturer Part: 0402CG200J500NT; Supplier Footprint: 0402; JLCPCB Part Class: Basic Part; Datasheet: https://atta.szlcsc.com/upload/public/pdf/source/20170923/C1554_1506149268708988361.pdf; Supplier: LCSC; Convert to PCB: yes
C4 C6-C8 C10 = CGA0603X5R106K100JT: 电容10uf; Manufacturer: HRE(芯声); Add into BOM: yes; Value: 10uF; Tolerance: ±10%; Voltage Rating: 10V; Temperature Coefficient: X5R; Symbol: CGA0603X5R106K100JT; Device: CGA0603X5R106K100JT; LCSC Part Name: 10uF ±10% 10V; Supplier Part: C6119842; Manufacturer Part: CGA0603X5R106K100JT; Supplier Footprint: 0603; JLCPCB Part Class: Extended Part; Supplier: LCSC; Convert to PCB: yes
C12 C22-C24 = 0402C_105: 电容1uf; Manufacturer: FH(风华); Name: 20pF; Symbol: 0402CG200J500NT; Add into BOM: yes; Value: 20pF; Tolerance: ±5%; Voltage Rated: 50V; Temperature Coefficient: C0G; Device: 0402CG200J500NT; LCSC Part Name: 20pF ±5% 50V; Supplier Part: C1554; Manufacturer Part: 0402CG200J500NT; Supplier Footprint: 0402; JLCPCB Part Class: Basic Part; Datasheet: https://atta.szlcsc.com/upload/public/pdf/source/20170923/C1554_1506149268708988361.pdf; Supplier: LCSC; Convert to PCB: yes
C13 = 0402B471K500NT: 电容470pf; Manufacturer: FH(风华); Add into BOM: yes; Value: 470pF; Tolerance: ±10%; Voltage Rating: 50V; Temperature Coefficient: X7R; Symbol: 0402B471K500NT; Device: 0402B471K500NT; LCSC Part Name: 470pF ±10% 50V; Supplier Part: C1537; Manufacturer Part: 0402B471K500NT; Supplier Footprint: 0402; JLCPCB Part Class: Extended Part; Datasheet: https://item.szlcsc.com/datasheet/0402B471K500NT/1889.html; Supplier: LCSC; Convert to PCB: yes
C18 C19 C25 C26 = 0402C_200: 电容20pf; Manufacturer: FH(风华); Name: 20pF; Symbol: 0402CG200J500NT; Add into BOM: yes; Value: 20pF; Tolerance: ±5%; Voltage Rated: 50V; Temperature Coefficient: C0G; Device: 0402CG200J500NT; LCSC Part Name: 20pF ±5% 50V; Supplier Part: C1554; Manufacturer Part: 0402CG200J500NT; Supplier Footprint: 0402; JLCPCB Part Class: Basic Part; Datasheet: https://atta.szlcsc.com/upload/public/pdf/source/20170923/C1554_1506149268708988361.pdf; Supplier: LCSC; Convert to PCB: yes
C21 = CL31A107MQHNNNE: 电容100uf; Manufacturer: SAMSUNG(三星); Add into BOM: yes; Value: 100uF; Tolerance: ±20%; Voltage Rating: 6.3V; Temperature Coefficient: X5R; Symbol: CL31A107MQHNNNE; Device: CL31A107MQHNNNE; LCSC Part Name: 100uF ±20% 6.3V; Supplier Part: C15008; Manufacturer Part: CL31A107MQHNNNE; Supplier Footprint: 1206; JLCPCB Part Class: Basic Part; Datasheet: https://item.szlcsc.com/datasheet/CL31A107MQHNNNE/15681.html; Supplier: LCSC; Convert to PCB: yes
C27 C28 = 0402C_120: 电容12pf; Manufacturer: FH(风华); Name: 20pF; Symbol: 0402CG200J500NT; Add into BOM: yes; Value: 20pF; Tolerance: ±5%; Voltage Rated: 50V; Temperature Coefficient: C0G; Device: 0402CG200J500NT; LCSC Part Name: 20pF ±5% 50V; Supplier Part: C1554; Manufacturer Part: 0402CG200J500NT; Supplier Footprint: 0402; JLCPCB Part Class: Basic Part; Datasheet: https://atta.szlcsc.com/upload/public/pdf/source/20170923/C1554_1506149268708988361.pdf; Supplier: LCSC; Convert to PCB: yes
C29-C44 C46-C53 = 0402C: 电容; Manufacturer: FH(风华); Name: 20pF; Symbol: 0402CG200J500NT; Add into BOM: yes; Value: 20pF; Tolerance: ±5%; Voltage Rated: 50V; Temperature Coefficient: C0G; Device: 0402CG200J500NT; LCSC Part Name: 20pF ±5% 50V; Supplier Part: C1554; Manufacturer Part: 0402CG200J500NT; Supplier Footprint: 0402; JLCPCB Part Class: Basic Part; Datasheet: https://atta.szlcsc.com/upload/public/pdf/source/20170923/C1554_1506149268708988361.pdf; Supplier: LCSC; Convert to PCB: yes
C45 C54 = 0402C_225: 电容2.2uf; Manufacturer: FH(风华); Name: 20pF; Symbol: 0402CG200J500NT; Add into BOM: yes; Value: 20pF; Tolerance: ±5%; Voltage Rated: 50V; Temperature Coefficient: C0G; Device: 0402CG200J500NT; LCSC Part Name: 20pF ±5% 50V; Supplier Part: C1554; Manufacturer Part: 0402CG200J500NT; Supplier Footprint: 0402; JLCPCB Part Class: Basic Part; Datasheet: https://atta.szlcsc.com/upload/public/pdf/source/20170923/C1554_1506149268708988361.pdf; Supplier: LCSC; Convert to PCB: yes
D1-D3 = XL-1005SYGC_C22470306: LED黄绿; Manufacturer: XINGLIGHT(成兴光); Add into BOM: yes; Forward Voltage (VF): 2.3V; Power Dissipation: 50mW; Forward Current: 20mA; Dominant Wavelength: 565nm~575nm; Peak Wavelength: 572nm; Lens Color: 无色透明透镜; Luminous Intensity: 240mcd; Viewing Angle: 120°; Mounting Sytle: 正贴; Symbol: XL-1005SYGC_C22470306; Device: XL-1005SYGC_C22470306; LCSC Part Name: XL-1005SYGC; Supplier Part: C22470306; Manufacturer Part: XL-1005SYGC; Supplier Footprint: 0402; JLCPCB Part Class: Extended Part; Datasheet: https://atta.szlcsc.com/upload/public/pdf/source/20240218/8EA55035A64B003AF213B47ACC00F41E.pdf; Supplier: LCSC; Convert to PCB: yes; Operating Temperature: -20℃~+85℃
D4 = SS34: Manufacturer: R+O(宏嘉诚); Symbol: SS34_C7420365; Add into BOM: yes; Diode Configuration: 独立式; Voltage - Forward(Vf@If): 550mV@3.0A; Voltage - DC Reverse(Vr): 40V; Current - Rectified: 3A; Reverse Leakage Current (Ir): 200uA@40V; Device: SS34_C7420365; LCSC Part Name: 电压:40V 电流:3A; Supplier Part: C7420365; Manufacturer Part: SS34; Supplier Footprint: SMA(DO-214AC); JLCPCB Part Class: Extended Part; Datasheet: https://item.szlcsc.com/datasheet/SS34/8397187.html; Supplier: LCSC; Convert to PCB: yes
D5 D8 D9 = XL-1005SURC_C25503345: LED红; Manufacturer: XINGLIGHT(成兴光); Add into BOM: yes; Illumination Color: 红色; Voltage - Forward(Vf): 1.8V~2.4V; Power(Watts): 50mW; Forward Current: 20mA; Wavelength - Dominant: 615nm~630nm; Peak Wavelength: 625nm; Luminous Intensity: 200mcd; Viewing Angle: 120°; Symbol: XL-1005SURC_C25503345; Device: XL-1005SURC_C25503345; LCSC Part Name: 0402分光红贴片式发光二极管; Supplier Part: C25503345; Manufacturer Part: XL-1005SURC; Supplier Footprint: 0402; JLCPCB Part Class: Extended Part; Datasheet: https://item.szlcsc.com/datasheet/XL-1005SURC/27234956.html; Supplier: LCSC; Convert to PCB: yes; Operating Temperature: -40℃~+85℃
D6 D7 = 1N5819HW-7-F: 肖特基二极管; Manufacturer: DIODES(美台); Add into BOM: yes; Diode Configuration: 1个独立式; Voltage - Forward(Vf@If): 450mV@1A; Voltage - DC Reverse(Vr): 40V; Current - Rectified: 1A; Reverse Leakage Current (Ir): 1mA@40V; Operating Junction Temperature Range: -65℃~+150℃; Non-Repetitive Peak Forward Surge Current: 25A; Symbol: 1N5819HW-7-F; Device: 1N5819HW-7-F; LCSC Part Name: 电压:40V 电流:1A; Supplier Part: C82544; Manufacturer Part: 1N5819HW-7-F; Supplier Footprint: SOD-123; JLCPCB Part Class: Extended Part; Datasheet: https://item.szlcsc.com/datasheet/1N5819HW-7-F/83701.html; Supplier: LCSC; Convert to PCB: yes
D10 = XL-1005UOC: LED橙; Manufacturer: XINGLIGHT(成兴光); Add into BOM: yes; Illumination Color: 橙色; Voltage - Forward(Vf): 2.3V; Power(Watts): 50mW; Forward Current: 20mA; Wavelength - Dominant: 600nm~610nm; Peak Wavelength: 605nm; Lens Color: 无色透明透镜; Luminous Intensity: 350mcd; Viewing Angle: 120°; Symbol: XL-1005UOC; Device: XL-1005UOC; LCSC Part Name: 0402橙贴片式发光二极管; Supplier Part: C965791; Manufacturer Part: XL-1005UOC; Supplier Footprint: 0402; JLCPCB Part Class: Extended Part; Datasheet: https://item.szlcsc.com/datasheet/XL-1005UOC/1051400.html; Supplier: LCSC; Convert to PCB: yes; Color Temperature: -; Mounting Style: 正贴; Operating Temperature: -40℃~+85℃
D11 = BAT54C,215: 共阴二极管; Manufacturer: Nexperia(安世); Add into BOM: yes; Diode Configuration: 1对共阴极; Voltage - Forward(Vf@If): 800mV@100mA; Voltage - DC Reverse(Vr): 30V; Current - Rectified: 200mA; Reverse Leakage Current (Ir): 2uA@25V; Non-Repetitive Peak Forward Surge Current: 600mA; Symbol: BAT54C,215; Device: BAT54C,215; LCSC Part Name: 电压:30V 电流:200mA; Supplier Part: C37704; Manufacturer Part: BAT54C,215; Supplier Footprint: SOT-23; JLCPCB Part Class: Extended Part; Datasheet: https://item.szlcsc.com/datasheet/BAT54C%252C215/38684.html; Supplier: LCSC; Convert to PCB: yes
J1 = ZX-XH2.54-2PZZ: Manufacturer: Megastar(兆星); Add into BOM: yes; Pins Structure: 1x2P; Pitch: 2.5mm; Reference Series: XH; Number of PINs Per Row: 2; Current Rating: 3A; Voltage Rating: 250V; Plastic Material: PA66; Flame Retardant Rating: UL94V-0; Z-Height of the Board: 7mm; X-Length of Bottom Edge on Board (Spacing Line): 7.5mm; Y-Width of Bottom Edge on Board: 5.9mm; Symbol: ZX-XH2.54-2PZZ; Device: ZX-XH2.54-2PZZ; LCSC Part Name: 1x2P 间距:2.5mm 直插 系列:XH; Supplier Part: C7429632; Manufacturer Part: ZX-XH2.54-2PZZ; Supplier Footprint: 插件,P=2.5mm; JLCPCB Part Class: Extended Part; Datasheet: https://item.szlcsc.com/datasheet/ZX-XH2.54-2PZZ/8427549.html; Supplier: LCSC; Convert to PCB: yes; Mounting Type: 直插; Number of Pins: 2P; Number of Rows: 1; Row Spacing: -; Contact Material: 黄铜; Contact Plating: 锡; Operating Temperature: -25℃~+85℃; Supplementary Features: -; Color: 白色
J2 = AFC01-S14FCA-00: FPC; Manufacturer: JS(钜硕电子); Add into BOM: yes; Locking Feature: 翻盖式; Number of Contacts: 14P; Pitch: 0.5mm; FFC, FCB Thickness: 0.3mm; Symbol: AFC01-S14FCA-00; Device: AFC01-S14FCA-00; LCSC Part Name: 间距:0.5mm P数:14P 翻盖式 下接; Supplier Part: C262663; Manufacturer Part: AFC01-S14FCA-00; Supplier Footprint: SMD,P=0.5mm,卧贴; JLCPCB Part Class: Extended Part; Datasheet: https://atta.szlcsc.com/upload/public/pdf/source/20190816/C413942_2A72D1AC756EAE17EEDF756A339D4500.pdf; Supplier: LCSC; Convert to PCB: yes; Contact Type: 下接; Mounting Type: 卧贴; Height Above Board: 2mm; Operating Temperature Range: -
J3 J4 J7 J8 = WAFER-SH1.0-2PWB: 按键连接器; Manufacturer: XUNPU(讯普); Add into BOM: yes; Pins Structure: 1x2P; Pitch: 1mm; Reference Series: SH; Number of PINs Per Row: 2; Current Rating: 1A; Voltage Rating: 50V; Plastic Material: LCP; Supplementary Features: 辅助焊脚; Z-Height of the Board: 3.15mm; X-Length of Bottom Edge on Board (Spacing Line): 4.35mm; Y-Width of Bottom Edge on Board: 4.3mm; Symbol: WAFER-SH1.0-2PWB; Device: WAFER-SH1.0-2PWB; LCSC Part Name: 1x2P 间距:1mm 卧贴 系列:SH; Supplier Part: C3029341; Manufacturer Part: WAFER-SH1.0-2PWB; Supplier Footprint: SMD,P=1mm,卧贴; JLCPCB Part Class: Extended Part; Datasheet: https://item.szlcsc.com/datasheet/WAFER-SH1.0-2PWB/3561353.html; Supplier: LCSC; Convert to PCB: yes; Mounting Type: 卧贴; Number of Pins: 2P; Number of Rows: 1; Row Spacing: -; Contact Material: 黄铜; Contact Plating: 锡; Operating Temperature: -40℃~+85℃; Flame Retardant Rating: -; Color: 米色
J5 = AFC01-S40FCA-00: FPC; Manufacturer: JS(钜硕电子); Add into BOM: yes; Locking Feature: 翻盖式; Number of Contacts: 40P; Pitch: 0.5mm; FFC, FCB Thickness: 0.3mm; Symbol: AFC01-S40FCA-00; Device: AFC01-S40FCA-00; LCSC Part Name: 间距:0.5mm P数:40P 翻盖式 下接; Supplier Part: C262674; Manufacturer Part: AFC01-S40FCA-00; Supplier Footprint: SMD,P=0.5mm,卧贴; JLCPCB Part Class: Extended Part; Datasheet: https://item.szlcsc.com/datasheet/AFC01-S40FCA-00/253933.html; Supplier: LCSC; Convert to PCB: yes; Contact Type: 下接; Mounting Type: 卧贴; Height Above Board: 2mm
J6 = AFC01-S05FCA-00: DEBUG; Manufacturer: JS(钜硕电子); Add into BOM: yes; Locking Feature: 翻盖式; Number of Contacts: 5P; Pitch: 0.5mm; FFC, FCB Thickness: 0.3mm; Symbol: AFC01-S05FCA-00; Device: AFC01-S05FCA-00; LCSC Part Name: 间距:0.5mm P数:5P 翻盖式 下接; Supplier Part: C262654; Manufacturer Part: AFC01-S05FCA-00; Supplier Footprint: SMD,P=0.5mm,卧贴; JLCPCB Part Class: Extended Part; Datasheet: https://item.szlcsc.com/datasheet/AFC01-S05FCA-00/253913.html; Supplier: LCSC; Convert to PCB: yes; Contact Type: 下接; Mounting Type: 卧贴; Height Above Board: 2mm
L1 = BLM21PG221SN1D: 磁珠; Manufacturer: muRata(村田); Add into BOM: yes; Impedance @ Frequency: 220Ω@100MHz; Tolerance: ±25%; DC Resistance: 45mΩ; Current Rating: 2A; Circuits: 1; Symbol: BLM21PG221SN1D; Device: BLM21PG221SN1D; LCSC Part Name: 单路 0805磁珠 阻抗220Ω@100MHz; Supplier Part: C85840; Manufacturer Part: BLM21PG221SN1D; Supplier Footprint: 0805; JLCPCB Part Class: Extended Part; Datasheet: https://atta.szlcsc.com/upload/public/pdf/source/20180326/C118443_3FAC30E9A4F0E6B81275543C61E0685E.pdf; Supplier: LCSC; Convert to PCB: yes
L2 = BLM15AG100SN1D: Manufacturer: muRata(村田); Add into BOM: yes; Impedance @ Frequency: 10Ω@100MHz; DC Resistance(DCR): 25mΩ; Current Rating: 1A; Number of Circuits: 1; Symbol: BLM15AG100SN1D; Device: BLM15AG100SN1D; LCSC Part Name: 单路 0402磁珠 阻抗10Ω@100MHz; Supplier Part: C76882; Manufacturer Part: BLM15AG100SN1D; Supplier Footprint: 0402; JLCPCB Part Class: Extended Part; Datasheet: https://item.szlcsc.com/datasheet/BLM15AG100SN1D/78009.html; Supplier: LCSC; Convert to PCB: yes; Tolerance: -; Operating Temperature: -55℃~+125℃
Q1 Q2 Q5 Q6 = HL6042: Manufacturer: R+O(宏嘉诚); Add into BOM: yes; Number: 1个P沟道; Drain to Source Voltage: 20V; Current - Continuous Drain(Id): 5A; RDS(on): 43mΩ@4.5V; Pd - Power Dissipation: 1.5W; Gate Threshold Voltage (Vgs(th)): 900mV@250uA; Gate Charge(Qg): 11nC@4.5V; Input Capacitance(Ciss): 905pF; Reverse Transfer Capacitance (Crss@Vds): 115pF; Type: P沟道; Output Capacitance(Coss): 150pF; Symbol: HL6042; Device: HL6042; LCSC Part Name: 1个P沟道 耐压:20V 电流:5A; Supplier Part: C28646264; Manufacturer Part: HL6042; Supplier Footprint: SOT-23; JLCPCB Part Class: Extended Part; Datasheet: https://item.szlcsc.com/datasheet/HL6042/30381010.html; Supplier: LCSC; Convert to PCB: yes; Operating Temperature: -55℃~+150℃
Q3 Q4 Q8 = MMBT3904-E: NPN; Manufacturer: MDD(辰达半导体); Add into BOM: yes; Current - Collector(Ic): 200mA; Collector - Emitter Voltage VCEO: 40V; Pd - Power Dissipation: 200mW; DC Current Gain: 300@10mA,1V; Transition frequency(fT): 300MHz; Current - Collector Cutoff: 100nA; Vce Saturation(VCE(sat)): 500mV@50mA,5mA; Emitter-Base Voltage(Vebo): 6V; Number: 1个NPN; Symbol: MMBT3904-E; Device: MMBT3904-E; LCSC Part Name: NPN 电流:200mA 电压:40V; Supplier Part: C41371422; Manufacturer Part: MMBT3904-E; Supplier Footprint: SOT-23; JLCPCB Part Class: Extended Part; Datasheet: https://item.szlcsc.com/datasheet/MMBT3904-E/43133593.html; Supplier: LCSC; Convert to PCB: yes; type: NPN
Q7 = MMBT3906_C364311: PNP; Manufacturer: MDD(辰达半导体); Symbol: MMBT3906-2A; Add into BOM: yes; Current - Collector(Ic): 200mA; Collector - Emitter Voltage VCEO: 40V; Pd - Power Dissipation: 200mW; DC Current Gain: 300@10mA,1V; Transition frequency(fT): 300MHz; Current - Collector Cutoff: 100nA; Vce Saturation(VCE(sat)): 300mV@50mA,5mA; Emitter-Base Voltage(Vebo): 5V; Number: 1个PNP; Device: MMBT3906_C364311; LCSC Part Name: PNP 电流:200mA 电压:40V; Supplier Part: C364311; Manufacturer Part: MMBT3906; Supplier Footprint: SOT-23; JLCPCB Part Class: Extended Part; Datasheet: https://item.szlcsc.com/datasheet/MMBT3906/338623.html; Supplier: LCSC; Convert to PCB: yes; type: PNP; Operating Temperature: -55℃~+150℃
Q9 = S8050_C364312: NPN; Manufacturer: MDD(辰达半导体); Symbol: S8050-J3Y; Add into BOM: yes; Current - Collector(Ic): 500mA; Collector - Emitter Voltage VCEO: 25V; Pd - Power Dissipation: 300mW; Transition frequency(fT): 150MHz; Current - Collector Cutoff: 100nA; Vce Saturation(VCE(sat)): 600mV@500mA,50mA; Emitter-Base Voltage(Vebo): 5V; Device: S8050_C364312; LCSC Part Name: hFE:200-350 NPN 电流:500mA 电压:25V; Supplier Part: C364312; Manufacturer Part: S8050; Supplier Footprint: SOT-23; JLCPCB Part Class: Extended Part; Datasheet: https://item.szlcsc.com/datasheet/S8050/338624.html; Supplier: LCSC; Convert to PCB: yes; type: NPN; DC Current Gain: -; Operating Temperature: -55℃~+150℃; Number: -; Configuration: -
R1 R25 R52 = 0402WGF4702TCE: 电阻47K; Manufacturer: UNI-ROYAL(厚声); Add into BOM: yes; Value: 47kΩ; Tolerance: ±1%; Power(Watts): 62.5mW; Voltage-Supply(Max): 50V; Temperature Coefficient: ±100ppm/℃; Symbol: 0402WGF4702TCE; Device: 0402WGF4702TCE; LCSC Part Name: 47kΩ ±1% 62.5mW 厚膜电阻; Supplier Part: C25792; Manufacturer Part: 0402WGF4702TCE; Supplier Footprint: 0402; JLCPCB Part Class: Basic Part; Datasheet: https://item.szlcsc.com/datasheet/0402WGF4702TCE/26535.html; Supplier: LCSC; Convert to PCB: yes; Type: 厚膜电阻; Operating Temperature: -55℃~+155℃
R2 R3 R15 R16 R23 R26 R29 R31 R38 R44 R47 = 0402WGF2001TCE: 电阻2K; Manufacturer: UNI-ROYAL(厚声); Name: 10kΩ; Symbol: 0402WGF1002TCE; Add into BOM: yes; Value: 10kΩ; Tolerance: ±1%; Power(Watts): 62.5mW; Temperature Coefficient: ±100ppm/℃; Overload Voltage (Max): 50V; Device: 0402WGF1002TCE; LCSC Part Name: 10kΩ ±1% 62.5mW; Supplier Part: C25744; Manufacturer Part: 0402WGF1002TCE; Supplier Footprint: 0402; JLCPCB Part Class: Basic Part; Datasheet: https://atta.szlcsc.com/upload/public/pdf/source/20200306/C422600_1E6D84923E4A46A82E41ADD87F860B5C.pdf; Supplier: LCSC; Convert to PCB: yes; Type: 厚膜电阻; Operating Temperature Range: -55℃~+155℃
R4 = 0603WAF1201T5E: 电阻1.2K; Manufacturer: UNI-ROYAL(厚声); Add into BOM: yes; Value: 1.2kΩ; Tolerance: ±1%; Power(Watts): 100mW; Voltage-Supply(Max): 75V; Temperature Coefficient: ±100ppm/℃; Symbol: 0603WAF1201T5E; Device: 0603WAF1201T5E; LCSC Part Name: 1.2kΩ ±1% 100mW 厚膜电阻; Supplier Part: C22765; Manufacturer Part: 0603WAF1201T5E; Supplier Footprint: 0603; JLCPCB Part Class: Basic Part; Datasheet: https://item.szlcsc.com/datasheet/0603WAF1201T5E/23492.html; Supplier: LCSC; Convert to PCB: yes; Type: 厚膜电阻; Operating Temperature: -55℃~+155℃
R5 R8 R35 R37 R40 = 0402WGF1001TCE: 电阻1K; Manufacturer: UNI-ROYAL(厚声); Add into BOM: yes; Value: 1kΩ; Tolerance: ±1%; Power(Watts): 62.5mW; Voltage-Supply(Max): 50V; Temperature Coefficient: ±100ppm/℃; Symbol: 0402WGF1001TCE; Device: 0402WGF1001TCE; LCSC Part Name: 1kΩ ±1% 62.5mW 厚膜电阻; Supplier Part: C11702; Manufacturer Part: 0402WGF1001TCE; Supplier Footprint: 0402; JLCPCB Part Class: Basic Part; Datasheet: https://item.szlcsc.com/datasheet/0402WGF1001TCE/12256.html; Supplier: LCSC; Convert to PCB: yes; Type: 厚膜电阻; Operating Temperature: -55℃~+155℃
R6 R22 R32 = 0603WAF5100T5E: 电阻510R; Manufacturer: UNI-ROYAL(厚声); Add into BOM: yes; Value: 510Ω; Tolerance: ±1%; Power(Watts): 100mW; Voltage-Supply(Max): 75V; Temperature Coefficient: ±100ppm/℃; Symbol: 0603WAF5100T5E; Device: 0603WAF5100T5E; LCSC Part Name: 510Ω ±1% 100mW 厚膜电阻; Supplier Part: C23193; Manufacturer Part: 0603WAF5100T5E; Supplier Footprint: 0603; JLCPCB Part Class: Basic Part; Datasheet: https://item.szlcsc.com/datasheet/0603WAF5100T5E/23920.html; Supplier: LCSC; Convert to PCB: yes; Type: 厚膜电阻; Operating Temperature: -55℃~+155℃
R7 R9 R14 R17 = 0603WAF499JT5E: 电阻49.9R; Manufacturer: UNI-ROYAL(厚声); Add into BOM: yes; Value: 49.9Ω; Tolerance: ±1%; Power(Watts): 100mW; Voltage-Supply(Max): 75V; Temperature Coefficient: ±100ppm/℃; Symbol: 0603WAF499JT5E; Device: 0603WAF499JT5E; LCSC Part Name: 49.9Ω ±1% 100mW 厚膜电阻; Supplier Part: C23185; Manufacturer Part: 0603WAF499JT5E; Supplier Footprint: 0603; JLCPCB Part Class: Basic Part; Datasheet: https://item.szlcsc.com/datasheet/0603WAF499JT5E/23912.html; Supplier: LCSC; Convert to PCB: yes; Type: 厚膜电阻; Operating Temperature: -55℃~+155℃
R10 R13 = 0402WGF5101TCE: 电阻5.1K
R11 R27 R28 R33 = 0402WGF1003TCE: 电阻100K; Manufacturer: UNI-ROYAL(厚声); Name: 10kΩ; Symbol: 0402WGF1002TCE; Add into BOM: yes; Value: 10kΩ; Tolerance: ±1%; Power(Watts): 62.5mW; Temperature Coefficient: ±100ppm/℃; Overload Voltage (Max): 50V; Device: 0402WGF1002TCE; LCSC Part Name: 10kΩ ±1% 62.5mW; Supplier Part: C25744; Manufacturer Part: 0402WGF1002TCE; Supplier Footprint: 0402; JLCPCB Part Class: Basic Part; Datasheet: https://atta.szlcsc.com/upload/public/pdf/source/20200306/C422600_1E6D84923E4A46A82E41ADD87F860B5C.pdf; Supplier: LCSC; Convert to PCB: yes; Type: 厚膜电阻; Operating Temperature Range: -55℃~+155℃
R12 R19 R20 R24 R30 R34 R36 R39 R41 R45 R46 R48 R50 R51 R54 R55 = 0402WGF1002TCE: 电阻10K; Manufacturer: UNI-ROYAL(厚声); Name: 10kΩ; Add into BOM: yes; Value: 10kΩ; Tolerance: ±1%; Power(Watts): 62.5mW; Temperature Coefficient: ±100ppm/℃; Overload Voltage (Max): 50V; Symbol: 0402WGF1002TCE; Device: 0402WGF1002TCE; LCSC Part Name: 10kΩ ±1% 62.5mW; Supplier Part: C25744; Manufacturer Part: 0402WGF1002TCE; Supplier Footprint: 0402; JLCPCB Part Class: Basic Part; Datasheet: https://atta.szlcsc.com/upload/public/pdf/source/20200306/C422600_1E6D84923E4A46A82E41ADD87F860B5C.pdf; Supplier: LCSC; Convert to PCB: yes; Type: 厚膜电阻; Operating Temperature Range: -55℃~+155℃
R18 = 0402WGF1002TCE: res; Manufacturer: UNI-ROYAL(厚声); Name: 10kΩ; Add into BOM: yes; Value: 10kΩ; Tolerance: ±1%; Power(Watts): 62.5mW; Temperature Coefficient: ±100ppm/℃; Overload Voltage (Max): 50V; Symbol: 0402WGF1002TCE; Device: 0402WGF1002TCE; LCSC Part Name: 10kΩ ±1% 62.5mW; Supplier Part: C25744; Manufacturer Part: 0402WGF1002TCE; Supplier Footprint: 0402; JLCPCB Part Class: Basic Part; Datasheet: https://atta.szlcsc.com/upload/public/pdf/source/20200306/C422600_1E6D84923E4A46A82E41ADD87F860B5C.pdf; Supplier: LCSC; Convert to PCB: yes; Type: 厚膜电阻; Operating Temperature Range: -55℃~+155℃
R21 = 0603WAF1212T5E: 电阻12.1K; Manufacturer: UNI-ROYAL(厚声); Add into BOM: yes; Value: 12.1kΩ; Tolerance: ±1%; Power(Watts): 100mW; Voltage-Supply(Max): 75V; Temperature Coefficient: ±100ppm/℃; Symbol: 0603WAF1212T5E; Device: 0603WAF1212T5E; LCSC Part Name: 12.1kΩ ±1% 100mW 厚膜电阻; Supplier Part: C22864; Manufacturer Part: 0603WAF1212T5E; Supplier Footprint: 0603; JLCPCB Part Class: Extended Part; Datasheet: https://item.szlcsc.com/datasheet/0603WAF1212T5E/23591.html; Supplier: LCSC; Convert to PCB: yes; Type: 厚膜电阻; Operating Temperature: -55℃~+155℃
R49 = 0402WGF1000TCE: 电阻100R; Manufacturer: UNI-ROYAL(厚声); Add into BOM: yes; Value: 100Ω; Tolerance: ±1%; Power(Watts): 62.5mW; Overload Voltage (Max): 50V; Temperature Coefficient: ±200ppm/℃; Symbol: 0402WGF1000TCE; Device: 0402WGF1000TCE; LCSC Part Name: 100Ω ±1% 62.5mW 厚膜电阻; Supplier Part: C25076; Manufacturer Part: 0402WGF1000TCE; Supplier Footprint: 0402; JLCPCB Part Class: Basic Part; Datasheet: https://atta.szlcsc.com/upload/public/pdf/source/20200306/C422600_1E6D84923E4A46A82E41ADD87F860B5C.pdf; Supplier: LCSC; Convert to PCB: yes; Type: 厚膜电阻; Operating Temperature Range: -55℃~+155℃
R53 = 0402WGF2202TCE: 电阻22K; Manufacturer: UNI-ROYAL(厚声); Symbol: 0402WGF4702TCE; Add into BOM: yes; Value: 47kΩ; Tolerance: ±1%; Power(Watts): 62.5mW; Voltage-Supply(Max): 50V; Temperature Coefficient: ±100ppm/℃; Device: 0402WGF4702TCE; LCSC Part Name: 47kΩ ±1% 62.5mW 厚膜电阻; Supplier Part: C25792; Manufacturer Part: 0402WGF4702TCE; Supplier Footprint: 0402; JLCPCB Part Class: Basic Part; Datasheet: https://item.szlcsc.com/datasheet/0402WGF4702TCE/26535.html; Supplier: LCSC; Convert to PCB: yes; Type: 厚膜电阻; Operating Temperature: -55℃~+155℃
U1 = TP4056_C725790: 锂电池充电管理IC; Manufacturer: UMW(友台半导体); Add into BOM: yes; Name: TP4056; Symbol: TP4056_C725790; Device: TP4056_C725790; LCSC Part Name: TP4056; Supplier Part: C725790; Manufacturer Part: TP4056; Supplier Footprint: ESOP-8; JLCPCB Part Class: Extended Part; Datasheet: https://atta.szlcsc.com/upload/public/pdf/source/20211011/37515E71BA298E23D23475482C49633D.pdf; Supplier: LCSC; Convert to PCB: yes
U2 = LAN8720A-CP-TR: ETHER_PHY; Manufacturer: MICROCHIP(美国微芯); Add into BOM: yes; Applications Function: PHY收发器; Interface: RMII; Voltage - Supply: 1.6V~3.6V; Symbol: LAN8720A-CP-TR; Device: LAN8720A-CP-TR; LCSC Part Name: 小型RMIl 10/100以太网收发器，支持HP Auto-MDIX; Supplier Part: C45223; Manufacturer Part: LAN8720A-CP-TR; Supplier Footprint: QFN-24-EP(4x4); JLCPCB Part Class: Extended Part; Datasheet: https://item.szlcsc.com/datasheet/LAN8720A-CP-TR/46225.html; Supplier: LCSC; Convert to PCB: yes; Number of Channels: -; Operating Temperature: 0℃~+85℃
U3 U4 = AMS1117-3.3V_C5120796: Manufacturer: MSKSEMI(美森科); Add into BOM: yes; Output Type: 固定; Voltage - Supply: 18V; Output Voltage: 3.3V; Output Current: 1A; Voltage Dropout: 1.4V@(1A); standby current: 12mA; Output Configuration: 正极; Number of Outputs: 1; Symbol: AMS1117-3.3V_C5120796; Device: AMS1117-3.3V_C5120796; LCSC Part Name: 输入18V 输出3.3V 1A; Supplier Part: C5120796; Manufacturer Part: AMS1117-3.3V; Supplier Footprint: SOT-89; JLCPCB Part Class: Extended Part; Datasheet: https://item.szlcsc.com/datasheet/AMS1117-3.3V/5706251.html; Supplier: LCSC; Convert to PCB: yes; Operating Temperature: 0℃~+125℃
U6 = W25Q128JVSIQ: QSPI Norflash; Manufacturer: Winbond(华邦); Symbol: W25Q128JVSIQTR; Add into BOM: yes; Interface: SPI; Memory Size: 128Mbit; Clock Frequency: 133MHz; Voltage - Supply: 2.7V~3.6V; Standby Supply Current: 1uA; Program / Erase Cycles: 100000次; Page Programming Time (Tpp): 3ms; Block Erase Time(tBE): 120ms@(32KB); Data Retention - TDR (Year): 20年; Device: W25Q128JVSIQ; LCSC Part Name: 编带 支持双路/四路SPI接口的3V、128Mbit 串行闪存; Supplier Part: C97521; Manufacturer Part: W25Q128JVSIQ; Supplier Footprint: SOIC-8-208mil; JLCPCB Part Class: Basic Part; Datasheet: https://item.szlcsc.com/datasheet/W25Q128JVSIQ/98729.html; Supplier: LCSC; Convert to PCB: yes; Operating Temperature: -40℃~+85℃
U7 = W9825G6KH-6: SDRAM; Manufacturer: Winbond(华邦); Add into BOM: yes; Memory Size: 256Mbit; Clock Frequency: 166MHz; Voltage - Supply: 3V~3.6V; Symbol: W9825G6KH-6; Device: W9825G6KH-6; LCSC Part Name: 4M×4存储体×16位SDRAM; Supplier Part: C62246; Manufacturer Part: W9825G6KH-6; Supplier Footprint: TSOP-54-10.2mm; JLCPCB Part Class: Extended Part; Datasheet: https://item.szlcsc.com/datasheet/W9825G6KH-6/63303.html; Supplier: LCSC; Convert to PCB: yes; Operating Temperature: 0℃~+70℃
U8 = STM32F429IGT6: 主控; Manufacturer: ST(意法半导体); Add into BOM: yes; CPU Core: ARM-M4; CPU Maximum Speed: 180MHz; Program Storage Size: 1MB; Program Memory Type: FLASH; Number of I/O: 140; ADC (Bit): 12bit; Voltage - Supply: 1.8V~3.6V; Symbol: STM32F429IGT6; Device: STM32F429IGT6; LCSC Part Name: 带DSP和FPU的高性能高级系列ARM Cortex-M4 MCU，具有1 MB Flash、180 MHz CPU、ART加速器、Chrom-ART加速器、TFT、带SDRAM的FMC和TFT; Supplier Part: C54328; Manufacturer Part: STM32F429IGT6; Supplier Footprint: LQFP-176(24x24); JLCPCB Part Class: Extended Part; Datasheet: https://item.szlcsc.com/datasheet/STM32F429IGT6/55346.html; Supplier: LCSC; Convert to PCB: yes; DAC (Bit): 12bit; Applications: -
USB1 = TYPE-C 6P: Manufacturer: SHOU HAN(首韩); Add into BOM: yes; Gender: 母; Number of Ports: 1; Current Rating - Power (Max): 5A; Rated Voltage (Max): 20V; Connect-Disconnect Life: 3千次; Core Colour: 黑色; Symbol: TYPE-C 6P; Device: TYPE-C 6P; LCSC Part Name: Type-C 母 卧贴; Supplier Part: C456012; Manufacturer Part: TYPE-C 6P; Supplier Footprint: SMD; JLCPCB Part Class: Extended Part; Datasheet: https://atta.szlcsc.com/upload/public/pdf/source/20201203/C456012_B13F72044DF846EDBE9BDD0D1D3CD166.pdf; Supplier: LCSC; Convert to PCB: yes; Connector Type: Type-C; Standard: USB 3.1; Mounting Style: 卧贴; Number of Contacts: 6P; Operating Temperature Range: -40℃~+85℃
X1 X2 = XL2EL89CSI-111YLC-25M: 25Mhz; Symbol: X322516MLB4SI; Designer: U?; Device: X322516MLB4SI
X3 = XTF32032768JT00351011: RTC时钟晶振; Manufacturer: 同晶; Add into BOM: yes; Value: 32.768kHz; Normal temperature Frequency Tolerance: ±10ppm; Load Capacitance: 12pF; Equivalent Series Resistance(ESR): 70kΩ; Symbol: XTF32032768JT00351011; Device: XTF32032768JT00351011; LCSC Part Name: 32.768KHz 2P 3215 12pF ±10ppm -40~+85℃(-0.04ppm/℃^2); Supplier Part: C37635363; Manufacturer Part: XTF32032768JT00351011; Supplier Footprint: SMD3215-2P; JLCPCB Part Class: Extended Part; Datasheet: https://item.szlcsc.com/datasheet/XTF32032768JT00351011/39361295.html; Supplier: LCSC; Convert to PCB: yes; Type: 贴片晶振
U5 = DX-WF24: PCB DECAL: DX-WF24